# EAGLE design oresat-proto-card-7 (EAGLE 7.7.0)
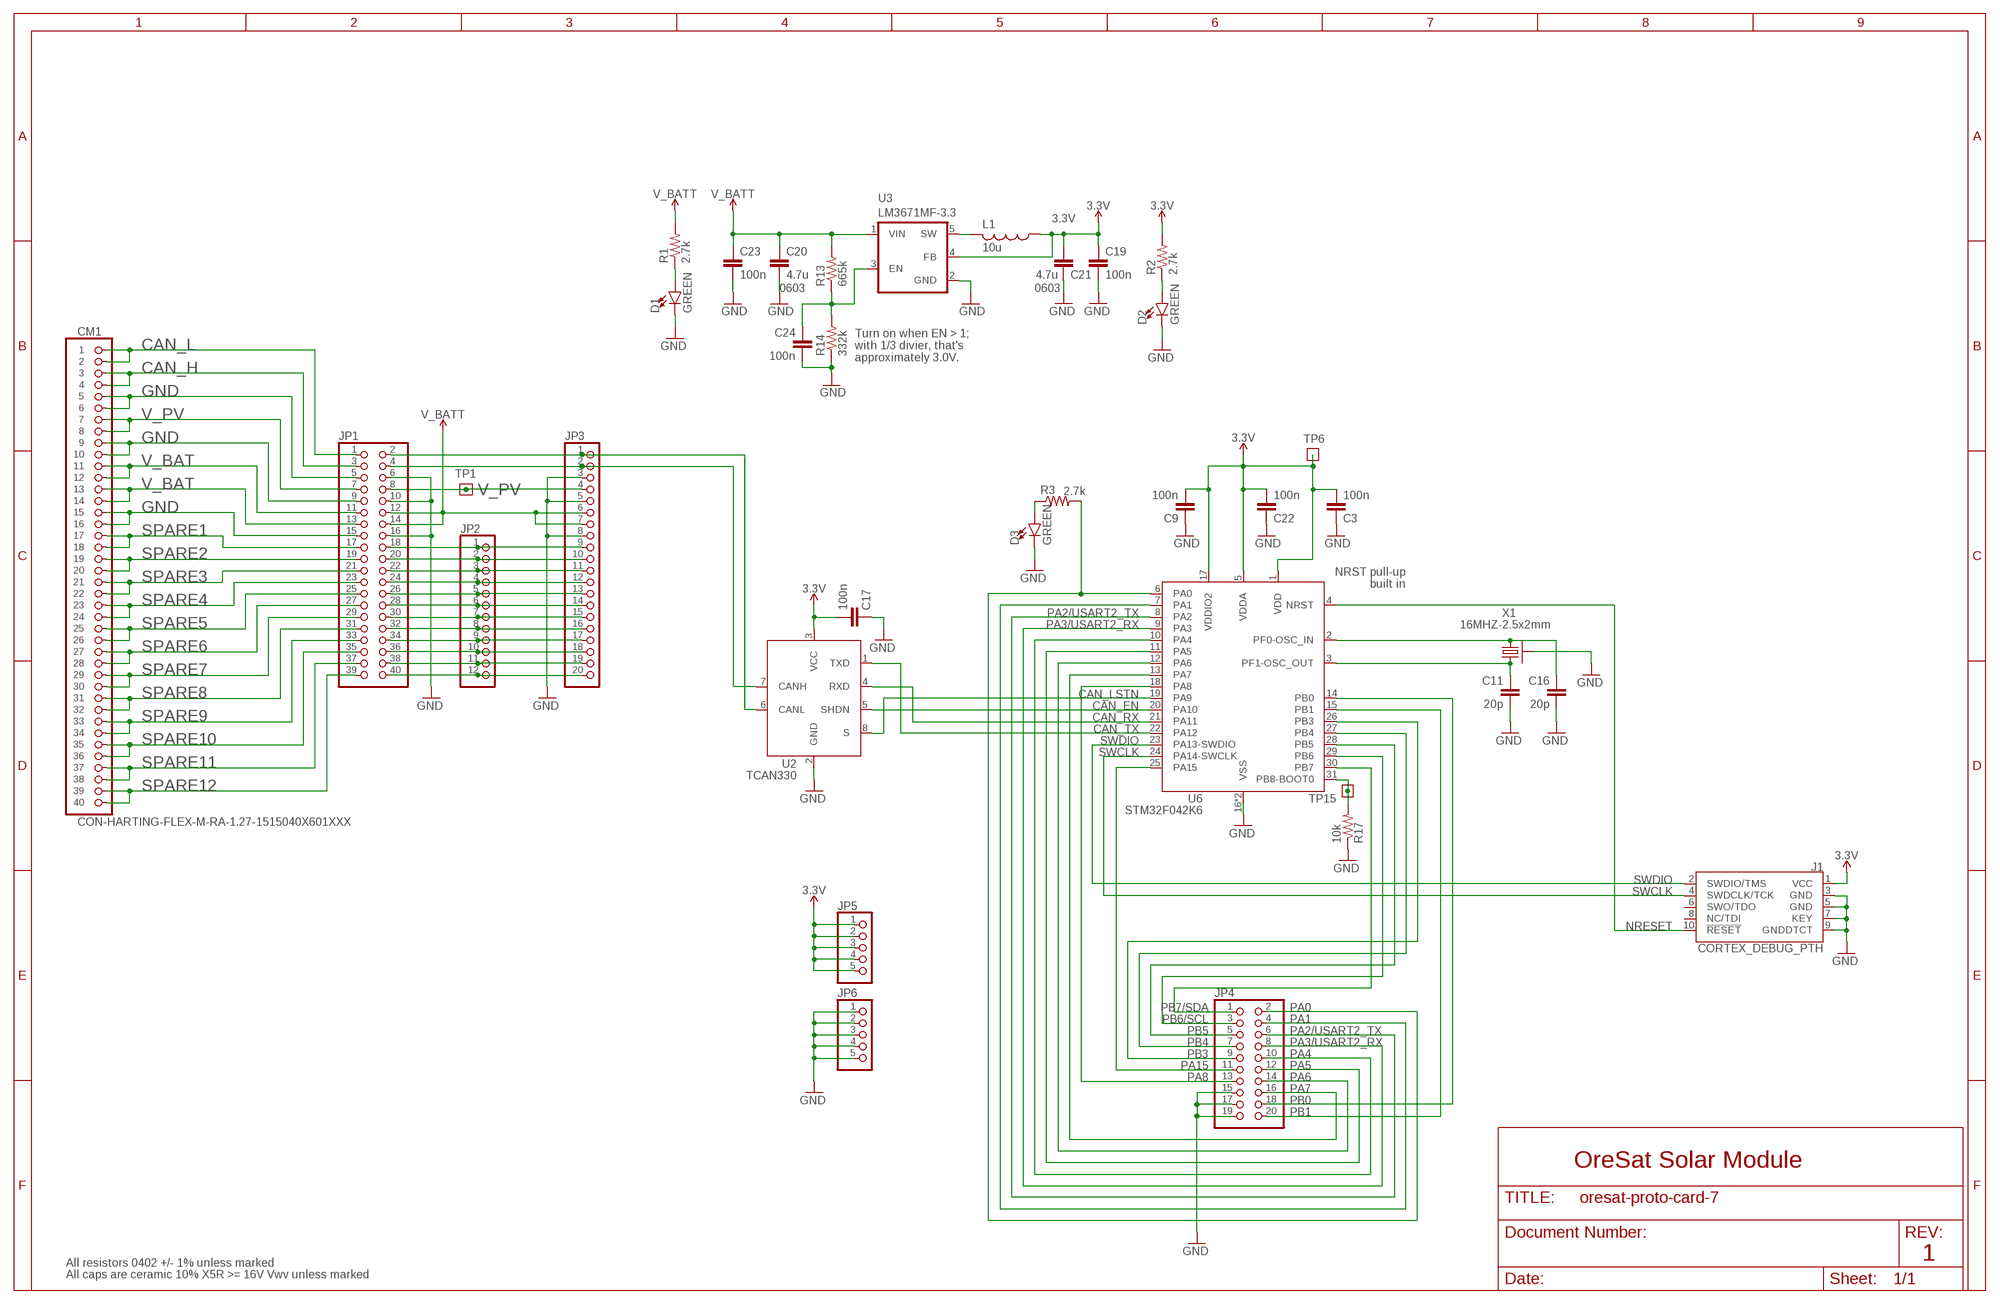
[diagram p0: schematic, sheet 1]

## Parts
C3  100n  C-EU0402-B-NOSILK  [.0402-B-NOSILK]
C9  100n  C-EU0402-B-NOSILK  [.0402-B-NOSILK]
C11  20p  C-EU0402-B-NOSILK  [.0402-B-NOSILK]
C16  20p  C-EU0402-B-NOSILK  [.0402-B-NOSILK]
C17  100n  C-EU0402-B-NOSILK  [.0402-B-NOSILK]
C19  100n  C-EU0402-B-NOSILK  [.0402-B-NOSILK]
C20  4.7u  C-EUC0603  [C0603]
C21  4.7u  C-EUC0603  [C0603]
C22  100n  C-EU0402-B-NOSILK  [.0402-B-NOSILK]
C23  100n  C-EU0402-B-NOSILK  [.0402-B-NOSILK]
C24  100n  C-EU0402-B-NOSILK  [.0402-B-NOSILK]
CM1  CON-HARTING-FLEX-M-RA-1.27-1515040X601XXX  [CON-1.27-M-RA-HARTING-1515040X601XXX]
D1  GREEN  LED-GREEN0603  [LED-0603]
D2  GREEN  LED-GREEN0603  [LED-0603]
D3  GREEN  LED-GREEN0603  [LED-0603]
J1  CORTEX_DEBUG_PTH  [2X5-PTH-1.27MM]
JP1  PINHD-2X20  [2X20]
JP2  PINHD-1X12  [1X12]
JP3  PINHD-1X20  [1X20]
JP4  PINHD-2X10  [2X10]
JP5  PINHD-1X5  [1X05]
JP6  PINHD-1X5  [1X05]
L1  10u  L-USL2012C  [L2012C]
R1  2.7k  R-US_0402-B-NOSILK  [.0402-B-NOSILK]
R2  2.7k  R-US_0402-B-NOSILK  [.0402-B-NOSILK]
R3  2.7k  R-US_0402-B-NOSILK  [.0402-B-NOSILK]
R13  665k  R-US_0402-B-NOSILK  [.0402-B-NOSILK]
R14  332k  R-US_0402-B-NOSILK  [.0402-B-NOSILK]
R17  10k  R-US_0402-B-NOSILK  [.0402-B-NOSILK]
TP1  TEST-POINT  [2MM-TEST-POINT]
TP6  TEST-POINT  [2MM-TEST-POINT]
TP15  TEST-POINT  [2MM-TEST-POINT]
U2  TCAN330  [SOT23-8_TI-DCN]
U3  LM3671MF-3.3  LM3761  [SOT23-5]
U6  STM32F042K6  [QFP32-7X7]
X1  16MHZ-2.5x2mm  CRYSTAL-WITH-GND  [CRYSTAL_2.5X2]

## Nets
3.3V: C3.2 C9.2 C17.2 C19.1 C21.1 C22.2 J1.1(VCC) JP5.1 JP5.2 JP5.3 JP5.4 JP5.5 L1.1 R2.2 TP6.1 U2.3(VCC) U3.4(FB) U6.1(VDD) U6.5(VDDA) U6.17(VDDIO2)
BOOT: R17.2 TP15.1 U6.31(PB8-BOOT0)
CAN_EN: U2.5(SHDN) U6.20(PA10)
CAN_H: CM1.3 CM1.4 JP1.3
CAN_L: CM1.1 CM1.2 JP1.1
CAN_LSTN: U2.8(S) U6.19(PA9)
CAN_RX: U2.4(RXD) U6.21(PA11)
CAN_TX: U2.1(TXD) U6.22(PA12)
CANH: JP1.4 JP3.2 U2.7(CANH)
CANL: JP1.2 JP3.1 U2.6(CANL)
CRYSTALIN: C16.1 U6.2(PF0-OSC_IN) X1.1
CRYSTALOUT: C11.1 U6.3(PF1-OSC_OUT) X1.3
GND: C3.1 C9.1 C11.2 C16.2 C17.1 C19.2 C20.2 C21.2 C22.1 C23.2 C24.2 CM1.5 CM1.6 CM1.9 CM1.10 CM1.15 CM1.16 D1.C D2.C D3.C J1.3(GND) J1.5(GND) J1.7(KEY) J1.9(GNDDTCT) JP1.5 JP1.6 JP1.9 JP1.10 JP1.15 JP1.16 JP3.3 JP3.5 JP3.8 JP4.15 JP4.17 JP4.19 JP6.1 JP6.2 JP6.3 JP6.4 JP6.5 R14.1 R17.1 U2.2(GND) U3.2(GND) U6.16(VSS) U6.32(VSS) X1.2(SHIELD) X1.4(SHIELD)
N$1: D3.A R3.1
N$2: JP1.8 JP3.4 TP1.1
N$3: JP1.18 JP2.1 JP3.9
N$4: JP1.20 JP2.2 JP3.10
N$22: JP1.22 JP2.3 JP3.11
N$23: JP1.24 JP2.4 JP3.12
N$24: JP1.26 JP2.5 JP3.13
N$25: JP1.28 JP2.6 JP3.14
N$26: JP1.30 JP2.7 JP3.15
N$27: JP1.32 JP2.8 JP3.16
N$28: JP1.34 JP2.9 JP3.17
N$29: JP1.36 JP2.10 JP3.18
N$30: JP1.38 JP2.11 JP3.19
N$31: JP1.40 JP2.12 JP3.20
N$270: D1.A R1.1
N$271: D2.A R2.1
NRESET: J1.10(!RESET) U6.4(NRST)
PA0: JP4.2 R3.2 U6.6(PA0)
PA1: JP4.4 U6.7(PA1)
PA2/USART2_TX: JP4.6 U6.8(PA2)
PA3/USART2_RX: JP4.8 U6.9(PA3)
PA4: JP4.10 U6.10(PA4)
PA5: JP4.12 U6.11(PA5)
PA6: JP4.14 U6.12(PA6)
PA7: JP4.16 U6.13(PA7)
PA8: JP4.13 U6.18(PA8)
PA15: JP4.11 U6.25(PA15)
PB0: JP4.18 U6.14(PB0)
PB1: JP4.20 U6.15(PB1)
PB3: JP4.9 U6.26(PB3)
PB4: JP4.7 U6.27(PB4)
PB5: JP4.5 U6.28(PB5)
PB6/SCL: JP4.3 U6.29(PB6)
PB7/SDA: JP4.1 U6.30(PB7)
SPARE1: CM1.17 CM1.18 JP1.17
SPARE2: CM1.19 CM1.20 JP1.19
SPARE3: CM1.21 CM1.22 JP1.21
SPARE4: CM1.23 CM1.24 JP1.23
SPARE5: CM1.25 CM1.26 JP1.25
SPARE6: CM1.27 CM1.28 JP1.27
SPARE7: CM1.29 CM1.30 JP1.29
SPARE8: CM1.31 CM1.32 JP1.31
SPARE9: CM1.33 CM1.34 JP1.33
SPARE10: CM1.35 CM1.36 JP1.35
SPARE11: CM1.37 CM1.38 JP1.37
SPARE12: CM1.39 CM1.40 JP1.39
STEPD: L1.2 U3.5(SW)
SWCLK: J1.4(SWDCLK/TCK) U6.24(PA14-SWCLK)
SWDIO: J1.2(SWDIO/TMS) U6.23(PA13-SWDIO)
V_BAT: CM1.11 CM1.12 CM1.13 CM1.14 JP1.11 JP1.13
V_BATT: C20.1 C23.1 JP1.12 JP1.14 JP3.6 JP3.7 R1.2 R13.2 U3.1(VIN)
V_PV: CM1.7 CM1.8 JP1.7
VDIV: C24.1 R13.1 R14.2 U3.3(EN)
Unconnected: J1.6(SWO/TDO) J1.8(NC/TDI)

## Notes on the sheet
- 0603 | 0603
- Turn on when EN > 1; 
  with 1/3 divier, that's
  approximately 3.0V.
- V_PV
- NRST pull-up
  built in
- OreSat Solar Module
- 1
- All resistors 0402 +/- 1% unless marked
- All caps are ceramic 10% X5R >= 16V Vwv unless marked

## Library data of the parts
C3 C9 C17 C19 C22-C24 = rcl_custom:C-EU: CAPACITOR, European symbol; DIS: Digi-Key; DPN: 1276-1001-1-ND; MFR: Samsung; MPN: CL05B104KO5NNNC
C11 C16 = rcl_custom:C-EU: CAPACITOR, European symbol; DIS: Digi-Key; DPN: 1276-6601-1-ND; MFR: Samsung; MPN: CL05C200JB51PNC
C20 C21 = rcl:C-EU: CAPACITOR, European symbol; DIS: Digi-Key; DPN: 1276-1001-1-ND; MFR: Samsung; MPN: CL05B104KO5NNNC
CM1 = oresat-eagle:CON-HARTING-FLEX-M-RA-1.27-1515040X601XXX
D1-D3 = SparkFun-LED:LED-GREEN: Green SMD LED Used in manufacturing of various products at SparkFun Packages: 0603 - SMD 0603 package [Product Link] <http://www.futureelectronics.com/en/technologies/semiconductors/optoelectronics/leds/Pages/9894312-LTST-C190GKT.aspx?CrossPart=HSMG-C190&IM=0> LilyPad 1206 - SMD1206 LilyPad package [Product Link] <http://www.futureelectronics.com/en/Technologies/Product.aspx?ProductID=IN150NGHARVATEKCORPORATION2049943&IM=0> 1206 - SMD1206 package [Product Link] <http://www.futureelectronics.com/en/technologies/semiconductors/optoelectronics/leds/Pages/8315665-LTST-C150KGKT.aspx?IM=0> 1206 Bottom Mount -SMD 1206 Bottom Mount [Product Link] <http://www.digikey.com/product-detail/en/lite-on-inc/LTST-C230KGKT/160-1456-1-ND/386854> SparkFun Products: Pro Mini 328 -5V <https://www.sparkfun.com/products/821> RedBoard <https://www.sparkfun.com/products/12757> MP3 Trigger <https://www.sparkfun.com/products/13720> Makey Makey <https://www.sparkfun.com/products/11076>; PROD_ID: DIO-00821
J1 = SparkFun-Connectors:CORTEX_DEBUG: Cortex Debug Connector - 10 pin Supports JTAG debug, Serial Wire debug, and Serial Wire Viewer. PTH and SMD connector options available. General Connector Information <http://infocenter.arm.com/help/topic/com.arm.doc.faqs/attached/13634/cortex_debug_connectors.pdf> Products: PTH Connector <http://www.digikey.com/product-detail/en/cnc-tech/3220-10-0100-00/1175-1627-ND/3883661> -via Digi-Key SparkFun PSoc <https://www.sparkfun.com/products/13229> SparkFun T <https://www.sparkfun.com/products/13810>
JP1 = pinhead:PINHD-2X20: PIN HEADER
JP2 = pinhead:PINHD-1X12: PIN HEADER
JP3 = pinhead:PINHD-1X20: PIN HEADER
JP4 = pinhead:PINHD-2X10: PIN HEADER
JP5 JP6 = pinhead:PINHD-1X5: PIN HEADER
L1 = rcl:L-US: INDUCTOR, American symbol; DIS: Digi-Key; DPN: 587-2452-1-ND; MFR: Taiyo Yuden; MPN: CB2012T100KR
R1-R3 R13 R17 = rcl_custom:R-US_: RESISTOR, American symbol; DIS: Digi-Key; DPN: 1276-4275-1-ND; MFR: Samsung; MPN: RC1005F6653CS
R14 = rcl_custom:R-US_: RESISTOR, American symbol; DIS: Digi-Key; DPN: 1276-4245-1-ND; MFR: Samsung; MPN: RC1005F3323CS
TP1 TP6 TP15 = Tova:TEST-POINT
U2 = TCAN330:TCAN330; DIS: Digi-Key; DPN: 296-44211-1-ND; MFR: Texas Instruments; MPN: TCAN330GDCNT
U3 = LM3761:LM3761: http://www.digikey.com/product-detail/en/texas-instruments/LM3671MF-3.3-NOPB/LM3671MF-3.3-NOPBCT-ND/1590190; DIS: Digi-Key; DPN: LM3671MF-3.3/NOPBCT-ND; MFR: TI; MPN: LM3671MF-3.3/NOPB
U6 = STM32F042K:STM32F042K6; DIS: Digi-Key; DPN: STM32F042K6T7-ND; MFR: STMicroelectronics; MPN: STM32F042K6T7
X1 = low-gain-radio:CRYSTAL-WITH-GND; DIS: Digi-Key; DPN: XC2181CT-ND; MFR: ECS Inc.; MPN: ECS-160-10-36Q-ES-TR

## Board
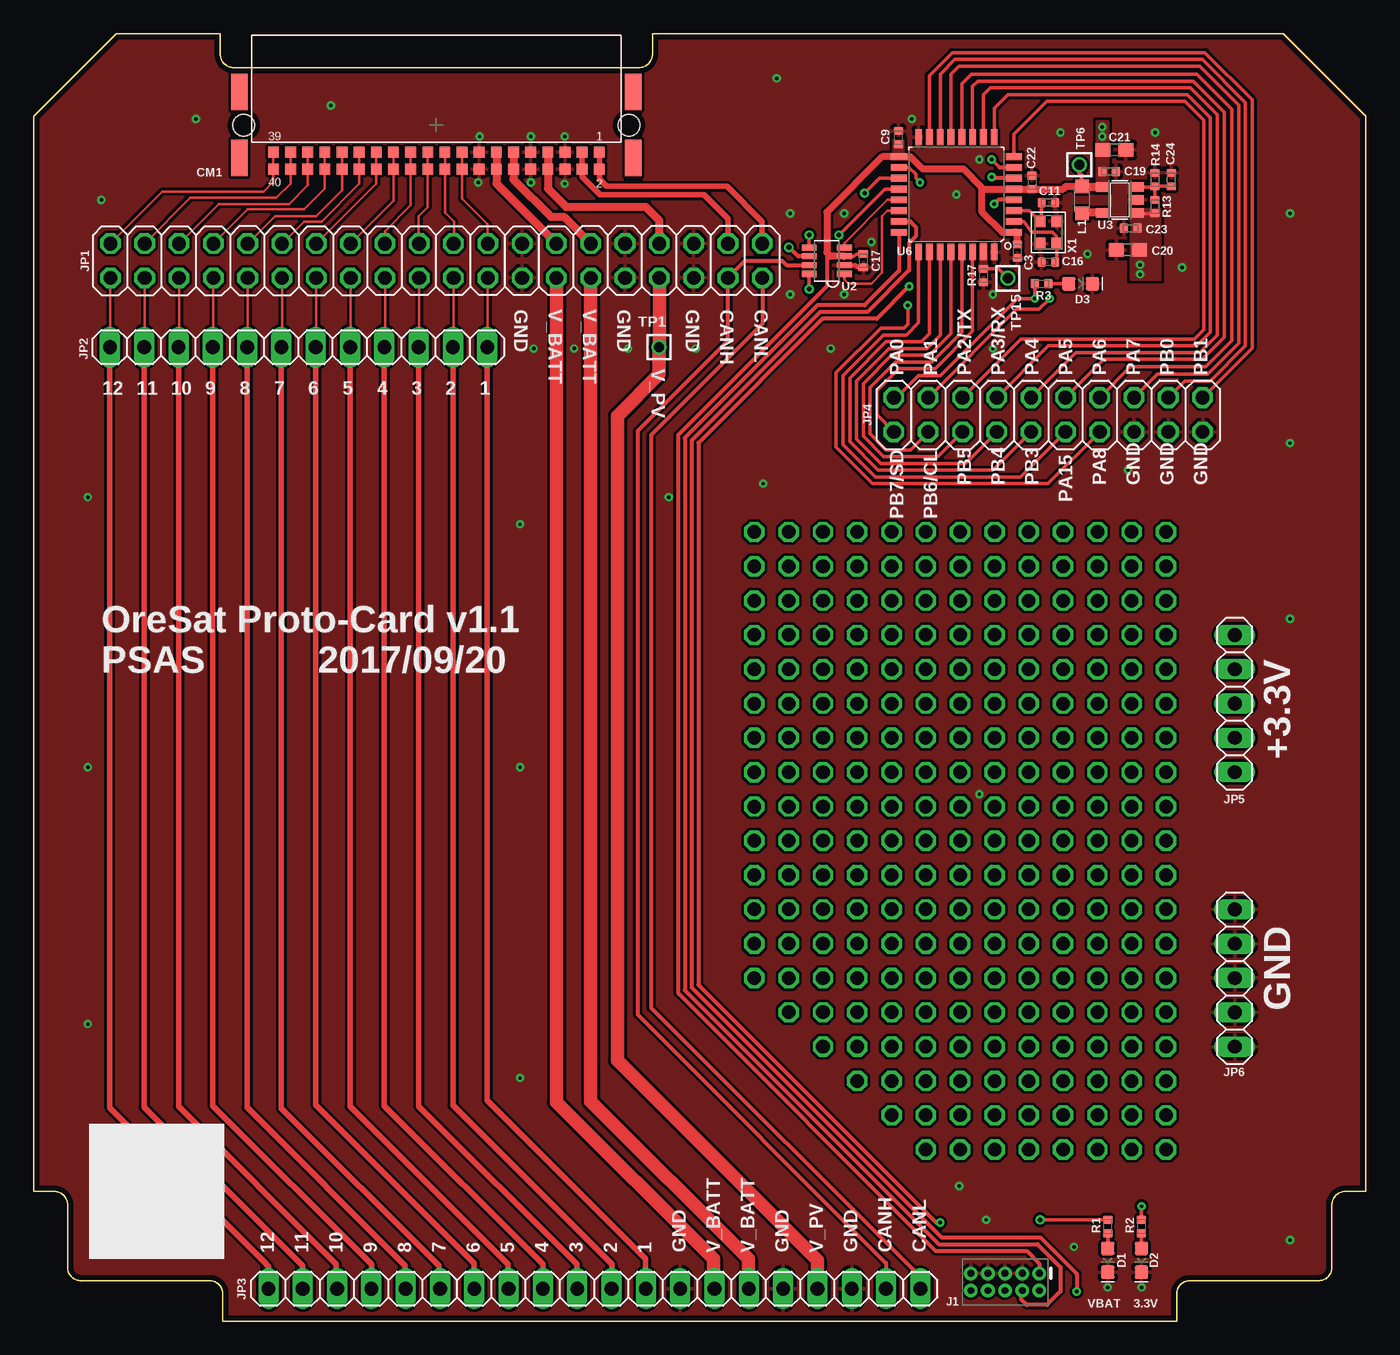
[diagram p1: board, top side]
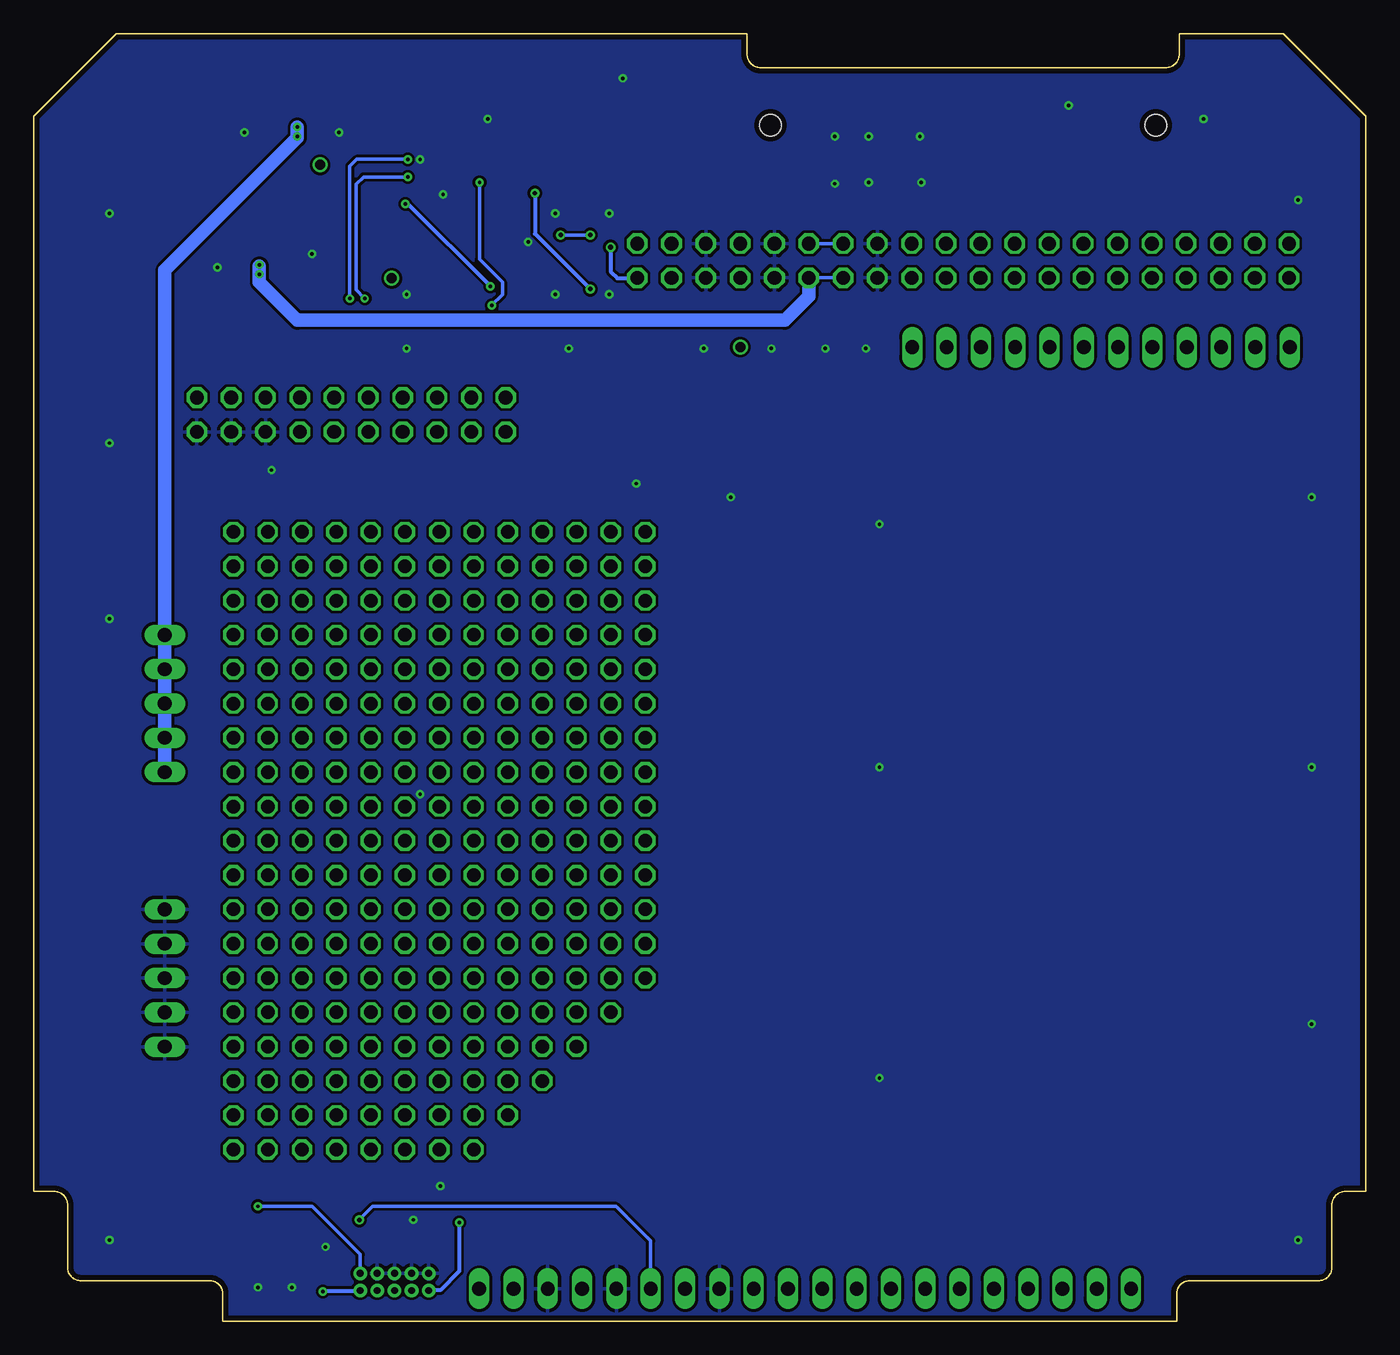
[diagram p2: board, bottom side, seen from below]

Size 98.6 x 95.3 mm. Coordinates in mm from the lower left corner, seen from the top.
Copper layers (1*16): Top 0.0356mm / dielectric 1.5011mm / Bottom 0.0356mm
Design rules "OSH-Park-2-layer *": minimum track width 6mil, minimum drill 10mil, track to track 6mil, track to pad 6mil, pad to pad 6mil, via to via 6mil, smd to smd 6mil, copper to edge 15mil, drill to drill 6mil, minimum pad ring 7mil, minimum via ring 7mil, stop-mask expansion 3mil, vias tented up to drill 13mil, thermal gap 10mil

### Footprints (pad centres in the part's own frame; a part is rotated, then mirrored left to right if it is on the bottom)
.0402-B-NOSILK = smd 0.6 x 0.7: 1 -0.5,0; 2 0.5,0
C0603 = smd 1.1 x 1: 1 -0.85,0; 2 0.85,0
CON-1.27-M-RA-HARTING-1515040X601XXX = smd 0.8 x 0.8: 1 -12.065,2; 2 -12.065,3.27; 3 -10.795,2; 4 -10.795,3.27; 5 -9.525,2; 6 -9.525,3.27; 7 -8.255,2; 8 -8.255,3.27; 9 -6.985,2; 10 -6.985,3.27; 11 -5.715,2; 12 -5.715,3.27; 13 -4.445,2; 14 -4.445,3.27; 15 -3.175,2; 16 -3.175,3.27; 17 -1.905,2; 18 -1.905,3.27; 19 -0.635,2; 20 -0.635,3.27; 21 0.635,2; 22 0.635,3.27; 23 1.905,2; 24 1.905,3.27; 25 3.175,2; 26 3.175,3.27; 27 4.445,2; 28 4.445,3.27; 29 5.715,2; 30 5.715,3.27; 31 6.985,2; 32 6.985,3.27; 33 8.255,2; 34 8.255,3.27; 35 9.525,2; 36 9.525,3.27; 37 10.795,2; 38 10.795,3.27; 39 12.065,2; 40 12.065,3.27 | smd 1.2 x 2.7: PAD1 -14.575,-2.45; PAD2 14.575,-2.45; PAD3 14.575,2.45; PAD4 -14.575,2.45 | hole 1.6: 14.275,0; -14.275,0
LED-0603 = smd 1 x 1: A -0.877,0; C 0.877,0
2X5-PTH-1.27MM = drill 0.508 pad 1: 1 -2.54,-0.635; 2 -2.54,0.635; 3 -1.27,-0.635; 4 -1.27,0.635; 5 0,-0.635; 6 0,0.635; 7 1.27,-0.635; 8 1.27,0.635; 9 2.54,-0.635; 10 2.54,0.635
2X20 = drill 1.016 octagon: 1 -24.13,-1.27; 2 -24.13,1.27; 3 -21.59,-1.27; 4 -21.59,1.27; 5 -19.05,-1.27; 6 -19.05,1.27; 7 -16.51,-1.27; 8 -16.51,1.27; 9 -13.97,-1.27; 10 -13.97,1.27; 11 -11.43,-1.27; 12 -11.43,1.27; 13 -8.89,-1.27; 14 -8.89,1.27; 15 -6.35,-1.27; 16 -6.35,1.27; 17 -3.81,-1.27; 18 -3.81,1.27; 19 -1.27,-1.27; 20 -1.27,1.27; 21 1.27,-1.27; 22 1.27,1.27; 23 3.81,-1.27; 24 3.81,1.27; 25 6.35,-1.27; 26 6.35,1.27; 27 8.89,-1.27; 28 8.89,1.27; 29 11.43,-1.27; 30 11.43,1.27; 31 13.97,-1.27; 32 13.97,1.27; 33 16.51,-1.27; 34 16.51,1.27; 35 19.05,-1.27; 36 19.05,1.27; 37 21.59,-1.27; 38 21.59,1.27; 39 24.13,-1.27; 40 24.13,1.27
1X12 = drill 1.016 long: 1 -13.97,0; 2 -11.43,0; 3 -8.89,0; 4 -6.35,0; 5 -3.81,0; 6 -1.27,0; 7 1.27,0; 8 3.81,0; 9 6.35,0; 10 8.89,0; 11 11.43,0; 12 13.97,0
1X20 = drill 1.016 long: 1 -24.13,0; 2 -21.59,0; 3 -19.05,0; 4 -16.51,0; 5 -13.97,0; 6 -11.43,0; 7 -8.89,0; 8 -6.35,0; 9 -3.81,0; 10 -1.27,0; 11 1.27,0; 12 3.81,0; 13 6.35,0; 14 8.89,0; 15 11.43,0; 16 13.97,0; 17 16.51,0; 18 19.05,0; 19 21.59,0; 20 24.13,0
2X10 = drill 1.016 octagon: 1 -11.43,-1.27; 2 -11.43,1.27; 3 -8.89,-1.27; 4 -8.89,1.27; 5 -6.35,-1.27; 6 -6.35,1.27; 7 -3.81,-1.27; 8 -3.81,1.27; 9 -1.27,-1.27; 10 -1.27,1.27; 11 1.27,-1.27; 12 1.27,1.27; 13 3.81,-1.27; 14 3.81,1.27; 15 6.35,-1.27; 16 6.35,1.27; 17 8.89,-1.27; 18 8.89,1.27; 19 11.43,-1.27; 20 11.43,1.27
1X05 = drill 1.016 long: 1 -5.08,0; 2 -2.54,0; 3 0,0; 4 2.54,0; 5 5.08,0
L2012C = smd 1 x 1: 1 -1,0; 2 1,0
2MM-TEST-POINT = drill 0.737: 1 0,0
SOT23-8_TI-DCN = smd 0.45 x 1.1: 1 -0.975,-1.3; 2 -0.325,-1.3; 3 0.325,-1.3; 4 0.975,-1.3; 5 0.975,1.3; 6 0.325,1.3; 7 -0.325,1.3; 8 -0.975,1.3
SOT23-5 = smd 0.69 x 0.99: 1 -0.95,-1.29; 2 0,-1.29; 3 0.95,-1.29; 4 0.95,1.3; 5 -0.95,1.3
QFP32-7X7 = smd 1.2 x 0.5: 1 -4.25,2.8; 2 -4.25,2; 3 -4.25,1.2; 4 -4.25,0.4; 5 -4.25,-0.4; 6 -4.25,-1.2; 7 -4.25,-2; 8 -4.25,-2.8; 17 4.25,-2.8; 18 4.25,-2; 19 4.25,-1.2; 20 4.25,-0.4; 21 4.25,0.4; 22 4.25,1.2; 23 4.25,2; 24 4.25,2.8 | smd 0.5 x 1.2: 9 -2.8,-4.25; 10 -2,-4.25; 11 -1.2,-4.25; 12 -0.4,-4.25; 13 0.4,-4.25; 14 1.2,-4.25; 15 2,-4.25; 16 2.8,-4.25; 25 2.8,4.25; 26 2,4.25; 27 1.2,4.25; 28 0.4,4.25; 29 -0.4,4.25; 30 -1.2,4.25; 31 -2,4.25; 32 -2.8,4.25
CRYSTAL_2.5X2 = smd 0.9 x 0.8: 1 -0.825,-0.625; 2 0.825,-0.625; 3 0.825,0.625; 4 -0.825,0.625

### Placement (x,y rotation side)
C3  72.8,79.2 90 top
C9  64,87.6 270 top
C11  75.1,82.8 0 top
C16  75.1,78.4 180 top
C17  61.4,78.5 90 top
C19  79.6,85.1 0 top
C20  81,79.3 180 top
C21  80,86.7 0 top
C22  73.9,84.3 270 top
C23  81.2,80.9 180 top
C24  84.2,84.5 90 top
CM1  29.8,88.54 180 top
D1  79.5,4.5 270 top
D2  82,4.5 270 top
D3  77.5,76.8 0 top
J1  71.9,2.9 180 top
JP1  29.8,78.5 180 top
JP2  19.6,72.1 180 top
JP3  41.5,2.4 180 top
JP4  75.1,67.1 0 top
JP5  88.9,45.72 90 top
JP6  88.9,25.4 90 top
L1  77.6,83 270 top
R1  79.5,7 90 top
R2  82,7 90 top
R3  74.6,76.8 180 top
R13  83,82.5 270 top
R14  83,84.5 270 top
R17  70.3,77.4 90 top
TP1  46.3,72.1 0 top
TP6  77.4,85.6 90 top
TP15  72.1,77.2 0 top
U2  58.7,78.5 90 top
U3  80.4,83 90 top
U6  68.3,83.4 180 top
U$1  [ORESAT-CARD-V0.5]  0,0 0 top
X1  75.1,80.6 90 top

### Tracks (layer width: path | path; a pad name or v marks a point on that pad's centre or on a via)
3.3V  (via drill 0.25)
  Top 0.25: v82,8.5 R2.2
  Top 0.254: U2.3 60.73,78.83 60.9,79 C17.2
  Top 0.3: L1.1 77.6,84.8 77.4,85 TP6.1 | 58.7,79.1 58.7,76.6 47.7,65.6 47.7,24.3 47.75,24.25 47.75,24.21 66.76,5.2 73.5,5.2 74.44,4.26 J1.1
  Top 0.5: U2.3 58.98,78.83 58.7,79.1 58.7,82.1 62.8,86.2 U6.17 64.9,86.2 65.8,85.3 68.8,85.3 70.2,83.9 70.2,83.8 | 70.2,83.8 70.2,82.1 71.7,80.6 U6.1 72.8,80.6 C3.2 | 70.2,83.8 U6.5 C22.2 76.2,83.8 76.4,84 L1.1
  Top 0.6: U3.4 77.75,83.95 L1.1
  Bottom 0.25: J1.1 74.44,4.94 78,8.5 v82,8.5
  Bottom 1: v79.1,88.4 v79.1,87.7 79.1,87.6 88.9,77.8 JP5.5 JP5.4 JP5.3 JP5.2 JP5.1
  pour Top (isolate 0.25, no thermals): 79.5,88.79 79.5,83.7 78.75,83.7 78.75,88.79
  pour Top (no thermals): 63.6,86.1 64.4,86.1 64.4,87.4 63.6,87.4
BOOT
  Top 0.254: R17.2 71.4,77.9 TP15.1
  pour Top (no thermals): 70.4,79.7 70.4,78.1 70.5,78.1 70.5,77.8 70.1,77.8 70.1,78.1 70.2,78.1 70.2,79.7
CAN_EN  (via drill 0.33)
  Top 0.25: v59.6,80.4 63,83.8 U6.20 | v57.4,80.4 U2.5
  Bottom 0.25: v59.6,80.4 v57.4,80.4
CAN_H
  Top 0.4: CM1.3 CM1.4 40.59,84.7 41.9,83.4 49.6,83.4 51.4,81.6 JP1.3
CAN_L
  Top 0.4: CM1.1 CM1.2 41.87,84.53 42.4,84 51.3,84 53.9,81.4 53.9,79.7 54,79.6 54,79.7 JP1.1
CAN_LSTN  (via drill 0.33)
  Top 0.25: v57.4,76.4 U2.8 | v61.5,83.5 62.6,84.6 U6.19
  Bottom 0.3: v61.5,83.5 61.5,80.5 v57.4,76.4
CAN_RX
  Top 0.2: U6.21 63.2,83 60,79.8 U2.4
CAN_TX
  Top 0.2: U6.22 63.2,82.2 62.8,81.8 62.8,77.6 62,76.8 60.3,76.8 60,77.1 U2.1
CANH
  Top 0.3: JP3.2 63.1,4.3 44.7,22.7 44.7,65.9 51.39,72.59 JP1.4 52.66,78.5 55.4,78.5 55.73,78.17 U2.7
CANL  (via drill 0.35)
  Top 0.3: JP1.2 53.93,73.83 45.7,65.6 45.7,23.2 65.7,3.2 65.7,2.47 JP3.1 | U2.6 56.58,78.83 v55.9,79.5
  Bottom 0.3: v55.9,79.5 55.9,77.7 55.4,77.2 53.96,77.2 JP1.2
CRYSTALIN
  Top 0.25: C16.1 75.72,78.53 X1.1 75.7,79.8 75.7,80.3 75.4,80.6 73.9,80.6 73.3,81.4 U6.2
CRYSTALOUT
  Top 0.25: U6.3 73.7,82.2 X1.3 74.6,81.55 C11.1
GND  (via drill 0.25)
  Top 0.3: U2.2 60.83,78.17 61,78 C17.1
  other vias: 33,87.7 93,82 47,61 36.8,87.7 39.3,87.7 39.3,84.2 36.8,84.3 32.9,84.3 68.3,83.4 62,79.9 78,79 76,88 83,88 85,78 71,72 59,72 56,82 70,86 65,89 71,76 81,63 54,62 93,65 93,52 93,6 5,6 4,22 36,18 36,41 36,59 4,41 4,61 5,83 12,89 22,90 55,92 56,76 60,76 60,82 49,72 44,72 40,72 37,72 70,39 77,5.5 70.5,7.5 68.5,10 79.5,2.5 82,2.5
  pour Top (isolate 0.2, rank 6): 0,0 98.6,0 98.6,95.3 0,95.3
  pour Bottom (isolate 0.2, rank 6): 0,0 98.6,0 98.6,95.3 0,95.3
N$1
  Top 0.25: R3.1 D3.A
N$2
  Top 0.2: TP1.1
  Top 1: JP1.8 TP1.1 | TP1.1 46.3,70.1 43.2,67 43.2,19.3 58,4.5 58,2.3 JP3.4
N$3
  Top 0.2: JP1.18 33.61,72.14 JP2.1
  Top 0.4: JP2.1 33.57,16.33 45.3,4.6 JP3.9
N$4
  Top 0.2: JP1.20 31.07,72.14 JP2.2
  Top 0.4: JP2.2 31.03,15.97 42.8,4.2 42.8,2.5 42.9,2.4 JP3.10
N$22
  Top 0.2: JP1.22 28.53,72.14 JP2.3
  Top 0.4: JP2.3 28.49,15.91 40.2,4.2 40.2,2.43 JP3.11
N$23
  Top 0.2: JP1.24 25.99,72.14 JP2.4
  Top 0.4: JP2.4 25.95,15.95 37.7,4.2 JP3.12
N$24
  Top 0.2: JP1.26 23.45,72.14 JP2.5
  Top 0.4: JP2.5 23.41,15.89 35.1,4.2 35.1,2.45 JP3.13
N$25
  Top 0.2: JP1.28 20.91,72.14 JP2.6
  Top 0.4: JP2.6 20.87,16.03 32.6,4.3 JP3.14
N$26
  Top 0.2: JP1.30 18.37,72.14 JP2.7
  Top 0.4: JP2.7 18.33,15.77 30,4.1 30,2.47 JP3.15
N$27
  Top 0.2: JP1.32 15.83,72.14 JP2.8
  Top 0.4: JP2.8 15.79,15.81 27.5,4.1 27.5,2.43 JP3.16
N$28
  Top 0.2: JP1.34 13.29,72.14 JP2.9
  Top 0.4: JP2.9 13.25,15.95 25,4.2 JP3.17
N$29
  Top 0.2: JP1.36 10.75,72.14 JP2.10
  Top 0.4: JP2.10 10.71,15.89 22.4,4.2 22.4,2.45 JP3.18
N$30
  Top 0.2: JP1.38 8.21,72.14 JP2.11
  Top 0.4: JP2.11 8.17,15.83 19.9,4.1 JP3.19
N$31
  Top 0.2: JP1.40 5.67,72.14 JP2.12
  Top 0.4: JP2.12 5.63,15.8 17.2,4.23 17.2,4.2 17.37,4.03 JP3.20
N$38  (via drill 1)
  other vias: 53.34,58.42
N$39  (via drill 1)
  other vias: 55.88,58.42
N$40  (via drill 1)
  other vias: 58.42,58.42
N$41  (via drill 1)
  other vias: 60.96,58.42
N$42  (via drill 1)
  other vias: 63.5,58.42
N$43  (via drill 1)
  other vias: 66.04,58.42
N$44  (via drill 1)
  other vias: 68.58,58.42
N$45  (via drill 1)
  other vias: 71.12,58.42
N$46  (via drill 1)
  other vias: 73.66,58.42
N$47  (via drill 1)
  other vias: 76.2,58.42
N$48  (via drill 1)
  other vias: 78.74,58.42
N$49  (via drill 1)
  other vias: 81.28,58.42
N$50  (via drill 1)
  other vias: 83.82,58.42
N$51  (via drill 1)
  other vias: 53.34,55.88
N$52  (via drill 1)
  other vias: 55.88,55.88
N$53  (via drill 1)
  other vias: 58.42,55.88
N$54  (via drill 1)
  other vias: 60.96,55.88
N$55  (via drill 1)
  other vias: 63.5,55.88
N$56  (via drill 1)
  other vias: 66.04,55.88
N$57  (via drill 1)
  other vias: 68.58,55.88
N$58  (via drill 1)
  other vias: 71.12,55.88
N$59  (via drill 1)
  other vias: 73.66,55.88
N$60  (via drill 1)
  other vias: 76.2,55.88
N$61  (via drill 1)
  other vias: 78.74,55.88
N$62  (via drill 1)
  other vias: 81.28,55.88
N$63  (via drill 1)
  other vias: 83.82,55.88
N$64  (via drill 1)
  other vias: 53.34,53.34
N$65  (via drill 1)
  other vias: 55.88,53.34
N$66  (via drill 1)
  other vias: 58.42,53.34
N$67  (via drill 1)
  other vias: 60.96,53.34
N$68  (via drill 1)
  other vias: 63.5,53.34
N$69  (via drill 1)
  other vias: 66.04,53.34
N$70  (via drill 1)
  other vias: 68.58,53.34
N$71  (via drill 1)
  other vias: 71.12,53.34
N$72  (via drill 1)
  other vias: 73.66,53.34
N$73  (via drill 1)
  other vias: 76.2,53.34
N$74  (via drill 1)
  other vias: 78.74,53.34
N$75  (via drill 1)
  other vias: 81.28,53.34
N$76  (via drill 1)
  other vias: 83.82,53.34
N$77  (via drill 1)
  other vias: 53.34,50.8
N$78  (via drill 1)
  other vias: 55.88,50.8
N$79  (via drill 1)
  other vias: 58.42,50.8
N$80  (via drill 1)
  other vias: 60.96,50.8
N$81  (via drill 1)
  other vias: 63.5,50.8
N$82  (via drill 1)
  other vias: 66.04,50.8
N$83  (via drill 1)
  other vias: 68.58,50.8
N$84  (via drill 1)
  other vias: 71.12,50.8
N$85  (via drill 1)
  other vias: 73.66,50.8
N$86  (via drill 1)
  other vias: 76.2,50.8
N$87  (via drill 1)
  other vias: 78.74,50.8
N$88  (via drill 1)
  other vias: 81.28,50.8
N$89  (via drill 1)
  other vias: 83.82,50.8
N$90  (via drill 1)
  other vias: 53.34,48.26
N$91  (via drill 1)
  other vias: 55.88,48.26
N$92  (via drill 1)
  other vias: 58.42,48.26
N$93  (via drill 1)
  other vias: 60.96,48.26
N$94  (via drill 1)
  other vias: 63.5,48.26
N$95  (via drill 1)
  other vias: 66.04,48.26
N$96  (via drill 1)
  other vias: 68.58,48.26
N$97  (via drill 1)
  other vias: 71.12,48.26
N$98  (via drill 1)
  other vias: 73.66,48.26
N$99  (via drill 1)
  other vias: 76.2,48.26
N$100  (via drill 1)
  other vias: 78.74,48.26
N$101  (via drill 1)
  other vias: 81.28,48.26
N$102  (via drill 1)
  other vias: 83.82,48.26
N$103  (via drill 1)
  other vias: 53.34,45.72
N$104  (via drill 1)
  other vias: 55.88,45.72
N$105  (via drill 1)
  other vias: 58.42,45.72
N$106  (via drill 1)
  other vias: 60.96,45.72
N$107  (via drill 1)
  other vias: 63.5,45.72
N$108  (via drill 1)
  other vias: 66.04,45.72
N$109  (via drill 1)
  other vias: 68.58,45.72
N$110  (via drill 1)
  other vias: 71.12,45.72
N$111  (via drill 1)
  other vias: 73.66,45.72
N$112  (via drill 1)
  other vias: 76.2,45.72
N$113  (via drill 1)
  other vias: 78.74,45.72
N$114  (via drill 1)
  other vias: 81.28,45.72
N$115  (via drill 1)
  other vias: 83.82,45.72
N$116  (via drill 1)
  other vias: 53.34,43.18
N$117  (via drill 1)
  other vias: 55.88,43.18
N$118  (via drill 1)
  other vias: 58.42,43.18
N$119  (via drill 1)
  other vias: 60.96,43.18
N$120  (via drill 1)
  other vias: 63.5,43.18
N$121  (via drill 1)
  other vias: 66.04,43.18
N$122  (via drill 1)
  other vias: 68.58,43.18
N$123  (via drill 1)
  other vias: 71.12,43.18
N$124  (via drill 1)
  other vias: 73.66,43.18
N$125  (via drill 1)
  other vias: 76.2,43.18
N$126  (via drill 1)
  other vias: 78.74,43.18
N$127  (via drill 1)
  other vias: 81.28,43.18
N$128  (via drill 1)
  other vias: 83.82,43.18
N$129  (via drill 1)
  other vias: 53.34,40.64
N$130  (via drill 1)
  other vias: 55.88,40.64
N$131  (via drill 1)
  other vias: 58.42,40.64
N$132  (via drill 1)
  other vias: 60.96,40.64
N$133  (via drill 1)
  other vias: 63.5,40.64
N$134  (via drill 1)
  other vias: 66.04,40.64
N$135  (via drill 1)
  other vias: 68.58,40.64
N$136  (via drill 1)
  other vias: 71.12,40.64
N$137  (via drill 1)
  other vias: 73.66,40.64
N$138  (via drill 1)
  other vias: 76.2,40.64
N$139  (via drill 1)
  other vias: 78.74,40.64
N$140  (via drill 1)
  other vias: 81.28,40.64
N$141  (via drill 1)
  other vias: 83.82,40.64
N$142  (via drill 1)
  other vias: 53.34,38.1
N$143  (via drill 1)
  other vias: 55.88,38.1
N$144  (via drill 1)
  other vias: 58.42,38.1
N$145  (via drill 1)
  other vias: 60.96,38.1
N$146  (via drill 1)
  other vias: 63.5,38.1
N$147  (via drill 1)
  other vias: 66.04,38.1
N$148  (via drill 1)
  other vias: 68.58,38.1
N$149  (via drill 1)
  other vias: 71.12,38.1
N$150  (via drill 1)
  other vias: 73.66,38.1
N$151  (via drill 1)
  other vias: 76.2,38.1
N$152  (via drill 1)
  other vias: 78.74,38.1
N$153  (via drill 1)
  other vias: 81.28,38.1
N$154  (via drill 1)
  other vias: 83.82,38.1
N$155  (via drill 1)
  other vias: 53.34,35.56
N$156  (via drill 1)
  other vias: 55.88,35.56
N$157  (via drill 1)
  other vias: 58.42,35.56
N$158  (via drill 1)
  other vias: 60.96,35.56
N$159  (via drill 1)
  other vias: 63.5,35.56
N$160  (via drill 1)
  other vias: 66.04,35.56
N$161  (via drill 1)
  other vias: 68.58,35.56
N$162  (via drill 1)
  other vias: 71.12,35.56
N$163  (via drill 1)
  other vias: 73.66,35.56
N$164  (via drill 1)
  other vias: 76.2,35.56
N$165  (via drill 1)
  other vias: 78.74,35.56
N$166  (via drill 1)
  other vias: 81.28,35.56
N$167  (via drill 1)
  other vias: 83.82,35.56
N$168  (via drill 1)
  other vias: 53.34,33.02
N$169  (via drill 1)
  other vias: 55.88,33.02
N$170  (via drill 1)
  other vias: 58.42,33.02
N$171  (via drill 1)
  other vias: 60.96,33.02
N$172  (via drill 1)
  other vias: 63.5,33.02
N$173  (via drill 1)
  other vias: 66.04,33.02
N$174  (via drill 1)
  other vias: 68.58,33.02
N$175  (via drill 1)
  other vias: 71.12,33.02
N$176  (via drill 1)
  other vias: 73.66,33.02
N$177  (via drill 1)
  other vias: 76.2,33.02
N$178  (via drill 1)
  other vias: 78.74,33.02
N$179  (via drill 1)
  other vias: 81.28,33.02
N$180  (via drill 1)
  other vias: 83.82,33.02
N$181  (via drill 1)
  other vias: 53.34,30.48
N$182  (via drill 1)
  other vias: 55.88,30.48
N$183  (via drill 1)
  other vias: 58.42,30.48
N$184  (via drill 1)
  other vias: 60.96,30.48
N$185  (via drill 1)
  other vias: 63.5,30.48
N$186  (via drill 1)
  other vias: 66.04,30.48
N$187  (via drill 1)
  other vias: 68.58,30.48
N$188  (via drill 1)
  other vias: 71.12,30.48
N$189  (via drill 1)
  other vias: 73.66,30.48
N$190  (via drill 1)
  other vias: 76.2,30.48
N$191  (via drill 1)
  other vias: 78.74,30.48
N$192  (via drill 1)
  other vias: 81.28,30.48
N$193  (via drill 1)
  other vias: 83.82,30.48
N$194  (via drill 1)
  other vias: 53.34,27.94
N$195  (via drill 1)
  other vias: 55.88,27.94
N$196  (via drill 1)
  other vias: 58.42,27.94
N$197  (via drill 1)
  other vias: 60.96,27.94
N$198  (via drill 1)
  other vias: 63.5,27.94
N$199  (via drill 1)
  other vias: 66.04,27.94
N$200  (via drill 1)
  other vias: 68.58,27.94
N$201  (via drill 1)
  other vias: 71.12,27.94
N$202  (via drill 1)
  other vias: 73.66,27.94
N$203  (via drill 1)
  other vias: 76.2,27.94
N$204  (via drill 1)
  other vias: 78.74,27.94
N$205  (via drill 1)
  other vias: 81.28,27.94
N$206  (via drill 1)
  other vias: 83.82,27.94
N$207  (via drill 1)
  other vias: 53.34,25.4
N$208  (via drill 1)
  other vias: 55.88,25.4
N$209  (via drill 1)
  other vias: 58.42,25.4
N$210  (via drill 1)
  other vias: 60.96,25.4
N$211  (via drill 1)
  other vias: 63.5,25.4
N$212  (via drill 1)
  other vias: 66.04,25.4
N$213  (via drill 1)
  other vias: 68.58,25.4
N$214  (via drill 1)
  other vias: 71.12,25.4
N$215  (via drill 1)
  other vias: 73.66,25.4
N$216  (via drill 1)
  other vias: 76.2,25.4
N$217  (via drill 1)
  other vias: 78.74,25.4
N$218  (via drill 1)
  other vias: 81.28,25.4
N$219  (via drill 1)
  other vias: 83.82,25.4
N$220  (via drill 1)
  other vias: 55.88,22.86
N$221  (via drill 1)
  other vias: 58.42,22.86
N$222  (via drill 1)
  other vias: 60.96,22.86
N$223  (via drill 1)
  other vias: 63.5,22.86
N$224  (via drill 1)
  other vias: 66.04,22.86
N$225  (via drill 1)
  other vias: 68.58,22.86
N$226  (via drill 1)
  other vias: 71.12,22.86
N$227  (via drill 1)
  other vias: 73.66,22.86
N$228  (via drill 1)
  other vias: 76.2,22.86
N$229  (via drill 1)
  other vias: 78.74,22.86
N$230  (via drill 1)
  other vias: 81.28,22.86
N$231  (via drill 1)
  other vias: 83.82,22.86
N$232  (via drill 1)
  other vias: 58.42,20.32
N$233  (via drill 1)
  other vias: 60.96,20.32
N$234  (via drill 1)
  other vias: 63.5,20.32
N$235  (via drill 1)
  other vias: 66.04,20.32
N$236  (via drill 1)
  other vias: 68.58,20.32
N$237  (via drill 1)
  other vias: 71.12,20.32
N$238  (via drill 1)
  other vias: 73.66,20.32
N$239  (via drill 1)
  other vias: 76.2,20.32
N$240  (via drill 1)
  other vias: 78.74,20.32
N$241  (via drill 1)
  other vias: 81.28,20.32
N$242  (via drill 1)
  other vias: 83.82,20.32
N$243  (via drill 1)
  other vias: 60.96,17.78
N$244  (via drill 1)
  other vias: 63.5,17.78
N$245  (via drill 1)
  other vias: 66.04,17.78
N$246  (via drill 1)
  other vias: 68.58,17.78
N$247  (via drill 1)
  other vias: 71.12,17.78
N$248  (via drill 1)
  other vias: 73.66,17.78
N$249  (via drill 1)
  other vias: 76.2,17.78
N$250  (via drill 1)
  other vias: 78.74,17.78
N$251  (via drill 1)
  other vias: 81.28,17.78
N$252  (via drill 1)
  other vias: 83.82,17.78
N$253  (via drill 1)
  other vias: 63.5,15.24
N$254  (via drill 1)
  other vias: 66.04,15.24
N$255  (via drill 1)
  other vias: 68.58,15.24
N$256  (via drill 1)
  other vias: 71.12,15.24
N$257  (via drill 1)
  other vias: 73.66,15.24
N$258  (via drill 1)
  other vias: 76.2,15.24
N$259  (via drill 1)
  other vias: 78.74,15.24
N$260  (via drill 1)
  other vias: 81.28,15.24
N$261  (via drill 1)
  other vias: 83.82,15.24
N$262  (via drill 1)
  other vias: 66.04,12.7
N$263  (via drill 1)
  other vias: 68.58,12.7
N$264  (via drill 1)
  other vias: 71.12,12.7
N$265  (via drill 1)
  other vias: 73.66,12.7
N$266  (via drill 1)
  other vias: 76.2,12.7
N$267  (via drill 1)
  other vias: 78.74,12.7
N$268  (via drill 1)
  other vias: 81.28,12.7
N$269  (via drill 1)
  other vias: 83.82,12.7
N$270
  Top 0.25: R1.1 D1.A
N$271
  Top 0.25: R2.1 D2.A
NRESET  (via drill 0.25)
  Top 0.3: U6.4 71.4,83 v71.1,82.7 | v64.8,76.6 62.4,74.2 58.4,74.2 49.2,65 49.2,24.9 66.8,7.3 v67.1,7.3
  Bottom 0.3: v71.1,82.7 70.9,82.7 v64.8,76.6 | v67.1,7.3 67.1,3.7 68.5,2.3 69.33,2.3 J1.10
PA0  (via drill 0.25)
  Top 0.25: 63.9,68.4 65.5,70 67.1,70 72.8,75.7 v74.1,75.7 R3.2
  Top 0.3: U6.6 71,84.6 v70.9,84.7 | 63.9,68.4 63.7,68.4 JP4.2
  Bottom 0.25: v70.9,84.7 74.2,84.7 74.75,84.15 74.75,76.35 v74.1,75.7
PA1  (via drill 0.25)
  Top 0.25: 71.5,85.4 v70.9,86 | JP4.4 72.74,74.9 74.4,74.9 v75.2,75.7
  Top 0.3: U6.7 71.5,85.4
  Bottom 0.25: v70.9,86 74.7,86 75.2,85.5 v75.2,75.7
PA2/USART2_TX
  Top 0.25: U6.8 72.55,87.85 75,90.3 85.2,90.3 86.6,88.9 86.6,73.4 85.9,72.7 73.08,72.7 JP4.6
PA3/USART2_RX
  Top 0.25: U6.9 71.1,89.8 72.1,90.8 85.4,90.8 87.1,89.1 87.1,73.2 86.1,72.2 75.12,72.2 JP4.8
PA4
  Top 0.25: U6.10 70.3,90.8 70.8,91.3 85.6,91.3 87.6,89.3 87.6,73 86.3,71.7 77.16,71.7 JP4.10
PA5
  Top 0.25: U6.11 69.5,91.4 69.9,91.8 85.85,91.8 88.15,89.5 88.15,72.85 86.5,71.2 79.2,71.2 JP4.12
PA6
  Top 0.25: U6.12 68.7,91.6 69.4,92.3 86.1,92.3 88.7,89.7 88.7,72.6 86.75,70.65 81.19,70.65 JP4.14
PA7
  Top 0.25: U6.13 67.9,92.3 68.5,92.9 86.3,92.9 89.2,90 89.2,72.4 86.9,70.1 83.18,70.1 JP4.16
PA8  (via drill 0.25)
  Top 0.25: U6.18 64.8,85.4 65.3,84.9 65.3,84.6 v65.6,84.3 | v64.7,75.2 64.7,73.8 64.4,73.5 62.7,73.5 59.4,70.2 59.4,64.7 62.1,62 75.08,62 JP4.13
  Bottom 0.25: v65.6,84.3 65.6,78.6 63.9,76.9 63.9,76 v64.7,75.2
PA15
  Top 0.25: U6.25 65.5,73.9 64.6,73 62.9,73 59.9,70 59.9,64.9 62.3,62.5 73.04,62.5 JP4.11
PB0
  Top 0.25: U6.14 67.1,92.3 68.2,93.4 86.5,93.4 89.7,90.2 89.7,72.2 87.1,69.6 85.22,69.6 JP4.18
PB1
  Top 0.25: U6.15 66.3,92.2 68,93.9 86.7,93.9 90.2,90.4 90.2,72.04 JP4.20
PB3
  Top 0.25: U6.26 66.3,73.1 65.7,72.5 63.1,72.5 60.4,69.8 60.4,65.1 62.5,63 71,63 JP4.9
PB4
  Top 0.25: U6.27 67.1,73 66.1,72 63.3,72 60.9,69.6 60.9,65.3 62.7,63.5 68.96,63.5 JP4.7
PB5
  Top 0.25: U6.28 67.9,73.1 66.3,71.5 63.5,71.5 61.4,69.4 61.4,65.5 62.9,64 66.92,64 JP4.5
PB6/SCL
  Top 0.25: JP4.3 64.88,64.5 63.1,64.5 61.9,65.7 61.9,69.1 63.8,71 66.5,71 68.7,73.2 U6.29
PB7/SDA
  Top 0.25: U6.30 69.5,75.8 69.5,74.6 69.5,73.3 66.73,70.53 64.03,70.53 62.4,68.9 62.4,67.1 JP4.1
SPARE1
  Top 0.2: CM1.17 CM1.18 31.7,83.09 33.6,81.2 JP1.17
  Top 0.4: JP1.17
SPARE2
  Top 0.2: CM1.19 CM1.20 30.43,82.06 31.1,81.4 31.1,79.8 JP1.19
SPARE3
  Top 0.2: CM1.21 CM1.22 29.16,82.47 28.5,81.8 28.5,79.8 JP1.21
SPARE4
  Top 0.2: CM1.23 CM1.24 27.89,82.59 26,80.7 JP1.23
SPARE5
  Top 0.2: CM1.25 CM1.26 26.62,82.94 JP1.25
SPARE6
  Top 0.2: CM1.27 CM1.28 25.36,84.22 JP1.27
SPARE7
  Top 0.2: CM1.29 CM1.30 24.09,84.19 21.3,81.4 20,81.4 JP1.29
SPARE8
  Top 0.2: CM1.31 22.82,85.48 22.9,85.4 22.9,85.36 CM1.32 22.82,83.72 20.9,81.8 17.86,81.8 JP1.31
SPARE9
  Top 0.2: CM1.33 CM1.34 21.55,83.84 20,82.3 15.82,82.3 JP1.33
SPARE10
  Top 0.2: CM1.35 CM1.36 20.27,84.08 18.9,82.7 13.68,82.7 JP1.35
SPARE11
  Top 0.2: CM1.37 CM1.38 19,84.2 17.95,83.15 11.59,83.15 JP1.37
SPARE12
  Top 0.2: CM1.39 CM1.40 17.73,84.33 17,83.6 9.5,83.6 JP1.39
STEPD
  Top 0.6: U3.5 77.75,82.05 L1.2
SWCLK
  Top 0.3: U6.24 64.05,77.75 61.5,75.2 58,75.2 48.2,65.4 48.2,24.5 67,5.7 74.3,5.7 76,4 76,2.2 75,1.2 73.5,1.2 73.1,1.6 73.1,2.19 J1.4 73.2,2.23
SWDIO  (via drill 0.25)
  Top 0.3: U6.23 64.9,81.4 65.3,81 65.3,80.3 64.8,79.8 64.8,77.8 61.7,74.7 58.2,74.7 48.7,65.2 48.7,24.7 67.2,6.2 74.5,6.2 77.2,3.5 v77.2,2.2
  Bottom 0.3: v77.2,2.2 77.14,2.27 J1.2
V_BAT
  Top 0.6: CM1.11 CM1.12 35.52,84.51 38.28,81.75 39.25,81.75 JP1.11 | CM1.13 CM1.14 34.24,84.22 JP1.13
  Bottom 0.25: JP1.13 JP1.11
V_BATT  (via drill 0.25, 0.33)
  Top 0.25: R13.2 81.74,82 | v74.5,7.5 R1.2
  Top 0.5: 81.74,82 U3.1
  Top 1: JP1.14 38.69,16.21 50.3,4.6 50.3,2.49 JP3.7 | JP1.12 41.23,16.27 52.9,4.6 52.9,2.43 JP3.6
  Bottom 0.25: JP1.14 JP1.12 | JP3.6 52.93,5.93 55.5,8.5 73.5,8.5 v74.5,7.5
  Bottom 0.254: v81.9,78.2 81.9,78.1
  Bottom 1: JP1.12 41.23,75.87 43,74.1 79.1,74.1 81.9,76.9 81.9,78.1
  other vias: 81.9,77.5
  pour Top (isolate 0.2, no thermals): 81.2,82.3 83.4,82.3 83.4,77.1 81.2,77.1
V_PV
  Top 0.6: CM1.7 CM1.8 38.05,83.84 39.4,82.5 45.3,82.5 46.3,81.5 JP1.7
VDIV
  Top 0.25: U3.3 83,83.95 | 83,83.95 R13.1 | 83,83.95 R14.2 C24.1

### Text on the board
tPlace: GND | V_BATT | V_BATT | GND | GND | CANH | CANL | V_PV | PA0 | PA1 | PA2/TX | PA3/RX | PA4 | PA5 | PA6 | PA7 | PB0 | PB1 | 12 | 11 | 10 | 9 | 8 | 7 | 6 | 5 | 4 | 3 | 2 | 1 | PB5 | PB4 | PB3 | PA8 | GND | GND | GND | PA15 | PB7/SD | PB6/CL | OreSat Proto-Card v1.1 | PSAS | 2017/09/20 | +3.3V | GND | 12 | 11 | 10 | 9 | 8 | 7 | 6 | 5 | 4 | 3 | 2 | 1 | GND | V_BATT | V_BATT | GND | V_PV | GND | CANH | CANL | VBAT | 3.3V